# EAGLE design isolated_module_open (EAGLE 6.5.0)
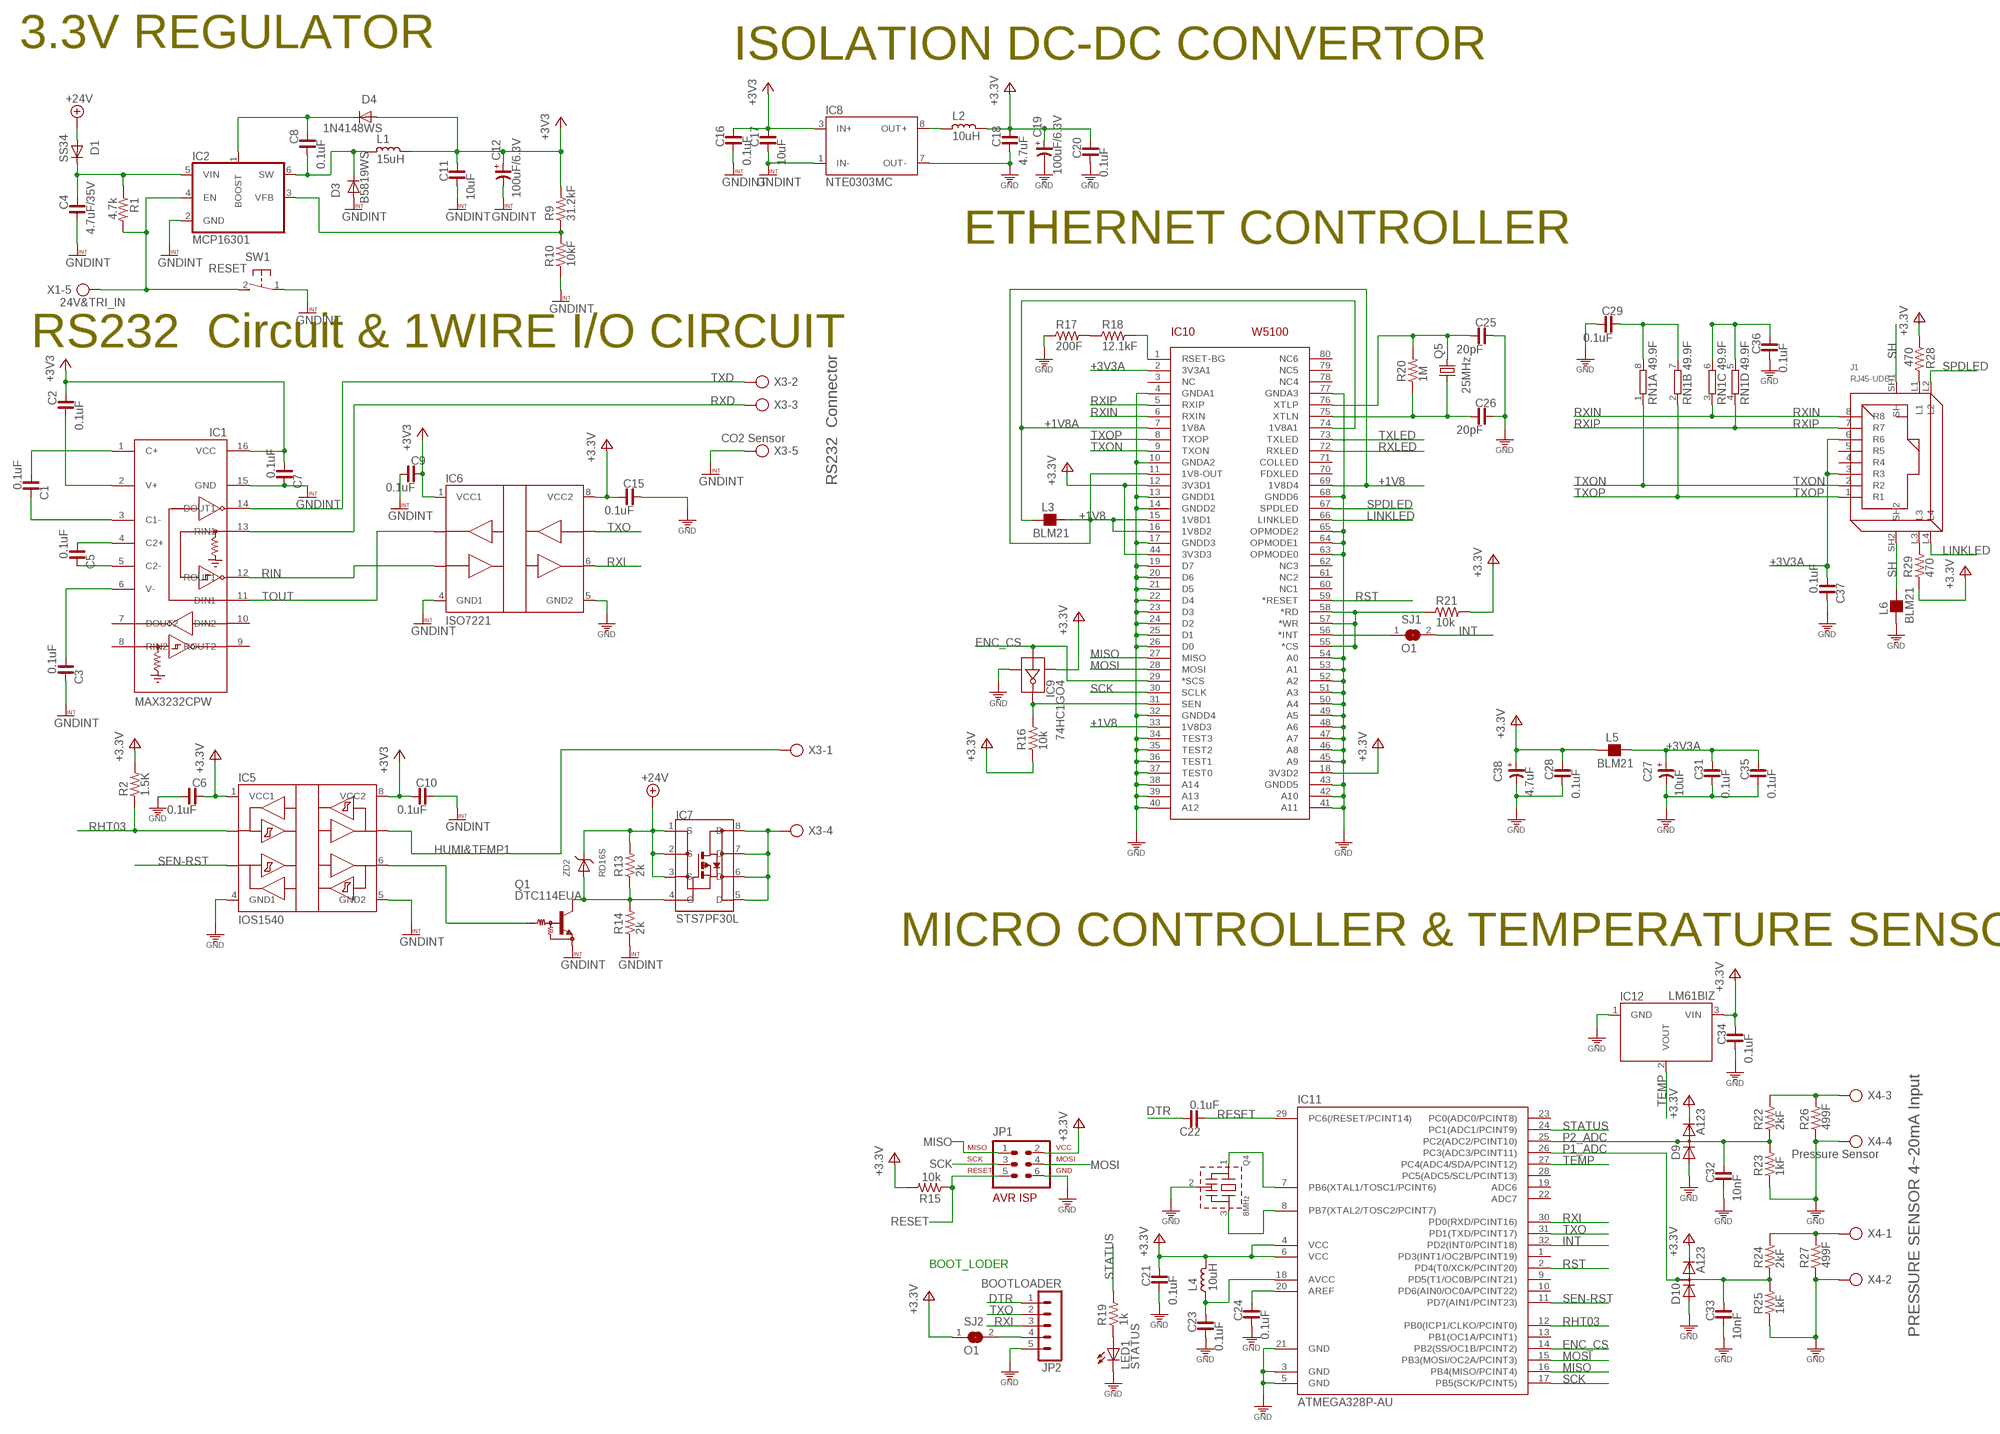
[diagram p0: schematic, sheet 1]

## Parts
C1  0.1uF  C_0603  [C0603]
C2  0.1uF  C_0603  [C0603]
C3  0.1uF  C_0603  [C0603]
C4  4.7uF/35V  C_3225  [C3225]
C5  0.1uF  C_0603  [C0603]
C6  0.1uF  C_0603  [C0603]
C7  0.1uF  C_0603  [C0603]
C8  0.1uF  C_0603  [C0603]
C9  0.1uF  C_0603  [C0603]
C10  0.1uF  C_0603  [C0603]
C11  10uF  C_0805  [C0805]
C12  100uF/6.3V  CP_3528-21  [C3528-21/T]
C15  0.1uF  C_0603  [C0603]
C16  0.1uF  C_0603  [C0603]
C17  10uF  C_0805  [C0805]
C18  4.7uF  C_0805  [C0805]
C19  100uF/6.3V  CP_3528-21  [C3528-21/T]
C20  0.1uF  C_0603  [C0603]
C21  0.1uF  C_0603  [C0603]
C22  0.1uF  C_0603  [C0603]
C23  0.1uF  C_0603  [C0603]
C24  0.1uF  C_0603  [C0603]
C25  20pF  C_0603  [C0603]
C26  20pF  C_0603  [C0603]
C27  10uF  CP_2012  [C2012/T]
C28  0.1uF  C_0603  [C0603]
C29  0.1uF  C_0603  [C0603]
C31  0.1uF  C_0603  [C0603]
C32  10nF  C_0603  [C0603]
C33  10nF  C_0603  [C0603]
C34  0.1uF  C_0603  [C0603]
C35  0.1uF  C_0603  [C0603]
C36  0.1uF  C_0603  [C0603]
C37  0.1uF  C_0603  [C0603]
C38  4.7uF  CP_2012  [C2012/T]
D1  SS34  DIODE-DO214AA  [DO214AA]
D3  B5819WS  B5189WN  [SOD323]
D4  1N4148WS  B5189WN  [SOD323]
D9  A123  DIODE_2CACA-SOT23  [SOT23]
D10  A123  DIODE_2CACA-SOT23  [SOT23]
IC1  MAX3232CPW  MAX3232MAX232CPW  [PW_R-PDSO-G16]
IC2  MCP16301  [SOT23-6L]
IC5  IOS1540  [SO08]
IC6  ISO7221  [SO8]
IC7  STS7PF30L  HEXFET_P  [SO08]
IC8  NTE0303MC  NTE0X0XMC  [NTE0505MC]
IC9  74HC1GO4  74HC1GO4GVSOT753  [SOT753]
IC10  W5100  [SQFP-S-10X10-80]
IC11  ATMEGA328P-AU  ATMEGA48/88/168-AU  [TQFP32-08]
IC12  LM61BIZ  LM61  [TO92-]
J1  RJ45-UDE  [RDA-126B1A1A]
JP1  AVR-ISP-6  [AVR-ISP-6]
JP2  BOOTLOADER  MA05-1IR  [MA05-1-IR]
L1  15uH  L_4545  [L4545]
L2  10uH  L_4545  [L4545]
L3  BLM21  FB_0603  [L0603]
L4  10uH  L_0805  [L0805]
L5  BLM21  FB_0603  [L0603]
L6  BLM21  FB_0603  [L0603]
LED1  STATUS  LEDSMD-1608  [LED-1608]
Q1  DTC114EUA  [SC59-BEC]
Q4  8MHz  X-TAL-SMALLRESONATOR  [CSTLA_X]
Q5  25MHz  CRYSTALSMD5032  [SMD5032]
R1  4.7k  R_0603  [R0603]
R2  1.5K  R_0603  [R0603]
R9  31.2kF  R_0603  [R0603]
R10  10kF  R_0603  [R0603]
R13  2k  R_0603  [R0603]
R14  2k  R_0603  [R0603]
R15  10k  R_0603  [R0603]
R16  10k  R_0603  [R0603]
R17  200F  R_0603  [R0603]
R18  12.1kF  R_0603  [R0603]
R19  1k  R_0603  [R0603]
R20  1M  R_0603  [R0603]
R21  10k  R_0603  [R0603]
R22  2kF  R_0603  [R0603]
R23  1kF  R_0603  [R0603]
R24  2kF  R_0603  [R0603]
R25  1kF  R_0603  [R0603]
R26  499F  R_0805  [R0805]
R27  499F  R_0805  [R0805]
R28  470  R_0603  [R0603]
R29  470  R_0603  [R0603]
RN1  49.9F  4R-N  [ARRAY_R3216]
SJ1  O1  SJ  [SJ]
SJ2  O1  SJ  [SJ]
SW1  RESET  DTSM-3  [DTSM-3]
X1  24V&TRI_IN  AK500/5  [AK500/5]
X3  CO2 Sensor  AK500/5  [AK500/5]
X4  Pressure Sensor  AK500/4  [AK500/4]
ZD2  RD16S  ZENER_DIODERD47S  [DSMM]

## Nets
3V3: C6.1 C15.2 C18.1 C19.+ C20.1 C21.1 C28.1 C34.1 C38.+ D9.2(C) D10.2(C) IC5.1(VCC1) IC6.8(VCC2) IC9.5(VDD) IC10.12(3V3D1) IC10.18(3V3D2) IC10.44(3V3D3) IC11.4(VCC) IC11.6(VCC) IC12.3(VIN) JP1.2 L2.1 L4.1 L5.1 R2.2 R15.2 R16.1 R21.2 R28.1 R29.1 SJ2.1 ; supply symbol labelled +3V3
+1V8: IC10.11(1V8-OUT) IC10.15(1V8D1) IC10.16(1V8D2) IC10.33(1V8D3) IC10.69(1V8D4) L3.2
+1V8A: IC10.7(1V8A) IC10.74(1V8A1) L3.1
+3V3: C2.1 C7.2 C9.1 C10.2 C11.1 C12.+ C16.1 C17.1 D4.A IC1.16(VCC) IC5.8(VCC2) IC6.1(VCC1) IC8.3(IN+) L1.1 R9.2
+3V3A: C27.+ C31.1 C35.1 C37.2 IC10.2(3V3A1) J1.3(R3) J1.6(R6) L5.2
+24V: D1.A IC7.1(S) IC7.2(S) IC7.3(S) R13.2 ZD2.C
DTR: C22.1 JP2.1
ENC_CS: IC9.2(A) IC10.29(*SCS) IC11.14(PB2(SS/OC1B/PCINT2))
GND [GND]: C6.2 C15.1 C18.2 C19.- C20.2 C21.2 C23.2 C24.2 C25.1 C26.1 C27.- C28.2 C29.2 C31.2 C32.2 C33.2 C34.2 C35.2 C36.2 C37.1 C38.- D9.1(A) D10.1(A) IC5.4(GND1) IC6.5(GND2) IC8.7(OUT-) IC9.3(GND) IC10.4(GNDA1) IC10.10(GNDA2) IC10.13(GNDD1) IC10.14(GNDD2) IC10.17(GNDD3) IC10.19(D7) IC10.20(D6) IC10.21(D5) IC10.22(D4) IC10.23(D3) IC10.24(D2) IC10.25(D1) IC10.26(D0) IC10.32(GNDD4) IC10.34(TEST3) IC10.35(TEST2) IC10.36(TEST1) IC10.37(TEST0) IC10.38(A14) IC10.39(A13) IC10.40(A12) IC10.41(A11) IC10.42(A10) IC10.43(GNDD5) IC10.45(A9) IC10.46(A8) IC10.47(A7) IC10.48(A6) IC10.49(A5) IC10.50(A4) IC10.51(A3) IC10.52(A2) IC10.53(A1) IC10.54(A0) IC10.63(OPMODE0) IC10.64(OPMODE1) IC10.65(OPMODE2) IC10.68(GNDD6) IC10.77(GNDA3) IC11.3(GND) IC11.5(GND) IC11.21(GND) IC12.1(GND) JP1.6 JP2.5 L6.1 LED1.C Q4.2(GND) R17.1 R23.1 R25.1 R26.1 R27.1 X4.2 X4.4
GNDINT [GND]: C3.1 C4.2 C7.1 C9.2 C10.1 C11.2 C12.- C16.2 C17.2 D3.A IC1.15(GND) IC2.2(GND) IC5.5(GND2) IC6.4(GND1) IC8.1(IN-) Q1.1(GND) R10.1 R14.1 SW1.1 X3.5
HUMI&TEMP1: IC5.7(SDA2) X3.1
INT: IC11.32(PD2(INT0/PCINT18)) SJ1.2
LINKLED: IC10.66(LINKLED) J1.L4
MISO: IC10.27(MISO) IC11.16(PB4(MISO/PCINT4)) JP1.1
MOSI: IC10.28(MOSI) IC11.15(PB3(MOSI/OC2A/PCINT3)) JP1.4
N$9: C5.1 IC1.5(C2-)
N$11: IC11.7(PB6(XTAL1/TOSC1/PCINT6)) Q4.1(IN)
N$12: IC11.8(PB7(XTAL2/TOSC2/PCINT7)) Q4.3(OUT)
N$13: C5.2 IC1.4(C2+)
N$14: C3.2 IC1.6(V-)
N$15: C2.2 IC1.2(V+)
N$16: C1.2 IC1.1(C+)
N$17: C1.1 IC1.3(C1-)
N$18: R22.2 R26.2 X4.3
N$19: C4.1 D1.C IC2.5(VIN) R1.1
N$20: LED1.A R19.1
N$22: IC10.55(*CS) IC10.57(*WR) IC10.58(*RD) R21.1
N$23: R17.2 R18.1
N$24: J1.L3 R29.2
N$25: J1.L1 R28.2
N$26: C36.1 RN1.5 RN1.6
N$27: IC10.56(*INT) SJ1.1
N$28: C29.1 RN1.7 RN1.8
N$29: IC10.1(RSET-BG) R18.2
N$30: IC8.8(OUT+) L2.2
N$31: C8.2 D3.C IC2.6(SW) L1.2
N$32: IC2.3(VFB) R9.1 R10.2
N$33: C8.1 D4.C IC2.1(BOOST)
N$34: IC2.4(EN) R1.2 SW1.2 X1.5
N$35: R24.2 R27.2 X4.1
N$36: C24.1 IC11.20(AREF)
N$37: C23.1 IC11.18(AVCC) L4.2
N$38: IC7.5(D) IC7.6(D) IC7.7(D) IC7.8(D) X3.4
N$39: IC5.6(SCL2) Q1.2(IN)
N$40: C25.2 IC10.76(XTLP) Q5.3 R20.2
N$41: IC7.4(G) Q1.3(OUT) R13.1 R14.2 ZD2.A
N$42: IC9.4(Y) IC10.31(SEN) R16.2
N$43: JP2.4 SJ2.2
N$49: C26.2 IC10.75(XTLN) Q5.1 R20.1
P1_ADC: C33.1 D10.3(AC) IC11.26(PC3(ADC3/PCINT11)) R24.1 R25.2
P2_ADC: C32.1 D9.3(AC) IC11.25(PC2(ADC2/PCINT10)) R22.1 R23.2
RESET: C22.2 IC11.29(PC6(/RESET/PCINT14)) JP1.5 R15.1
RHT03: IC5.2(SDA1) IC11.12(PB0(ICP1/CLKO/PCINT0)) R2.1
RIN: IC1.12(ROUT1) IC6.3(INB)
RST: IC10.59(*RESET) IC11.2(PD4(T0/XCK/PCINT20))
RXD: IC1.13(RIN1) X3.3
RXI: IC6.6(OUTB) IC11.30(PD0(RXD/PCINT16)) JP2.3
RXIN: IC10.6(RXIN) J1.8(R8) RN1.3
RXIP: IC10.5(RXIP) J1.7(R7) RN1.4
RXLED: IC10.72(RXLED)
SCK: IC10.30(SCLK) IC11.17(PB5(SCK/PCINT5)) JP1.3
SEN-RST: IC5.3(SCL1) IC11.11(PD7(AIN1/PCINT23))
SH: J1.SH1(SH) J1.SH2 L6.2
SPDLED: IC10.67(SPDLED) J1.L2
STATUS: IC11.24(PC1(ADC1/PCINT9)) R19.2
TEMP: IC11.27(PC4(ADC4/SDA/PCINT12)) IC12.2(VOUT)
TOUT: IC1.11(DIN1) IC6.2(OUTA)
TXD: IC1.14(DOUT1) X3.2
TXLED: IC10.73(TXLED)
TXO: IC6.7(INA) IC11.31(PD1(TXD/PCINT17)) JP2.2
TXON: IC10.9(TXON) J1.2(R2) RN1.1
TXOP: IC10.8(TXOP) J1.1(R1) RN1.2
Unconnected: IC1.7(DOUT2) IC1.8(RIN2) IC1.9(ROUT2) IC1.10(DIN2) IC10.3(NC) IC10.60(NC1) IC10.61(NC2) IC10.62(NC3) IC10.70(FDXLED) IC10.71(COLLED) IC10.78(NC4) IC10.79(NC5) IC10.80(NC6) IC11.1(PD3(INT1/OC2B/PCINT19)) IC11.9(PD5(T1/OC0B/PCINT21)) IC11.10(PD6(AIN0/OC0A/PCINT22)) IC11.13(PB1(OC1A/PCINT1)) IC11.19(ADC6) IC11.22(ADC7) IC11.23(PC0(ADC0/PCINT8)) IC11.28(PC5(ADC5/SCL/PCINT13)) J1.4(R4) J1.5(R5) X1.1 X1.2 X1.3 X1.4

## Notes on the sheet
- 3.3V REGULATOR | ISOLATION DC-DC CONVERTOR
- ETHERNET CONTROLLER
- RS232  Circuit & 1WIRE I/O CIRCUIT
- RS232  Connector
- MICRO CONTROLLER & TEMPERATURE SENSOR
- BOOT_LODER
- PRESSURE SENSOR 4~20mA Input

## Library data of the parts
C1-C11 C15-C18 C20-C26 C28 C29 C31-C37 = cona_lib:C_: NON-POLARIZED CAP
C12 C19 C27 C38 = rc-master-smd:CP_: POLARIZED CAP
D1 = cona_lib:DIODE-: DIODE
D3 D4 = cona_lib:B5189W
D9 D10 = diode:DIODE_2CACA-: 2 Diodes - Cathode-Anode|Cathode-Anode
IC1 = cona_lib:MAX3232: TI
IC2 = cona_lib:MCP16301
IC5 = cona_lib:IOS1540: Low-Power Bidirectional I 2C Isolators Supports up to 1 MHz Operation 3-V to 5.5-V Supply Range
IC6 = cona_lib:ISO7221
IC7 = cona_lib:HEXFET_P
IC8 = cona_lib:NTE0X0XMC
IC9 = cona_lib:74HC1GO4GV
IC10 = SmartPrj:W5100
IC11 = cona_lib:ATMEGA48/88/168
IC12 = cona_lib:LM61
J1 = cona_lib:RJ45-UDE
JP1 = cona_lib:AVR-ISP-6: AVR ISP-6 Serial Programming Header
JP2 = cona_lib:MA05-1
L1 L2 L4 = cona_lib:L_: INDUCTOR
L3 L5 L6 = rc-master-smd:FB_: FERRITE BEAD
LED1 = cona_lib:LED: LED OSRAM: - CHIPLED LG R971, LG N971, LY N971, LG Q971, LY Q971, LO R971, LY R971 LH N974, LH R974 LS Q976, LO Q976, LY Q976 LO Q996 - Hyper CHIPLED LW Q18S LB Q993, LB Q99A, LB R99A - SideLED LS A670, LO A670, LY A670, LG A670, LP A670 LB A673, LV A673, LT A673, LW A673 LH A674 LY A675 LS A676, LA A676, LO A676, LY A676, LW A676 LS A679, LY A679, LG A679 - Hyper Micro SIDELED® LS Y876, LA Y876, LO Y876, LY Y876 LT Y87S - SmartLED LW L88C, LW L88S LB L89C, LB L89S, LG L890 LS L89K, LO L89K, LY L89K LS L896, LA L896, LO L896, LY L896 - TOPLED LS T670, LO T670, LY T670, LG T670, LP T670 LSG T670, LSP T670, LSY T670, LOP T670, LYG T670 LG T671, LOG T671, LSG T671 LB T673, LV T673, LT T673, LW T673 LH T674 LS T676, LA T676, LO T676, LY T676, LB T676, LH T676, LSB T676, LW T676 LB T67C, LV T67C, LT T67C, LS T67K, LO T67K, LY T67K, LW E67C LS E67B, LA E67B, LO E67B, LY E67B, LB E67C, LV E67C, LT E67C LW T67C LS T679, LY T679, LG T679 LS T770, LO T770, LY T770, LG T770, LP T770 LB T773, LV T773, LT T773, LW T773 LH T774 LS E675, LA E675, LY E675, LS T675 LS T776, LA T776, LO T776, LY T776, LB T776 LHGB T686 LT T68C, LB T68C - Hyper Mini TOPLED® LB M676 - Mini TOPLED Santana® LG M470 LS M47K, LO M47K, LY M47K Source: http://www.osram.convergy.de LUXEON: - LUMILED® LXK2-PW12-R00, LXK2-PW12-S00, LXK2-PW14-U00, LXK2-PW14-V00 LXK2-PM12-R00, LXK2-PM12-S00, LXK2-PM14-U00 LXK2-PE12-Q00, LXK2-PE12-R00, LXK2-PE12-S00, LXK2-PE14-T00, LXK2-PE14-U00 LXK2-PB12-K00, LXK2-PB12-L00, LXK2-PB12-M00, LXK2-PB14-N00, LXK2-PB14-P00, LXK2-PB14-Q00 LXK2-PR12-L00, LXK2-PR12-M00, LXK2-PR14-Q00, LXK2-PR14-R00 LXK2-PD12-Q00, LXK2-PD12-R00, LXK2-PD12-S00 LXK2-PH12-R00, LXK2-PH12-S00 LXK2-PL12-P00, LXK2-PL12-Q00, LXK2-PL12-R00 Source: www.luxeon.com KINGBRIGHT: KA-3528ASYC Source: www.kingbright.com
Q1 = cona_lib:DTC114EUA: NPN Bias Resistor Transistor
Q4 = cona_lib:X-TAL-SMALL: Ceramic Resonators MuRata CSTCE08MOOG52A
Q5 = cona_lib:CRYSTAL: CRYSTAL
R1 R2 R9 R10 R13-R29 = cona_lib:R_: RESISTOR
RN1 = cona_lib:4R-N: Array Chip Resistor Source: RS Component / Phycomp
SJ1 SJ2 = cona_lib:SJ: SMD solder JUMPER
SW1 = switch-tact:DTSM-3
X1 X3 = con-ptr500:AK500/5: CONNECTOR; OC_FARNELL: unknown; OC_NEWARK: unknown
X4 = con-ptr500:AK500/4: CONNECTOR; OC_FARNELL: unknown; OC_NEWARK: unknown
ZD2 = GRU-EURO6:ZENER_DIODE

## Net classes
0 default: clearance 0.152 mm
1 +5V: width 0.2 mm, clearance 0.152 mm
2 GND: width 0.2 mm, drill 0.2 mm, clearance 0.152 mm

## Board
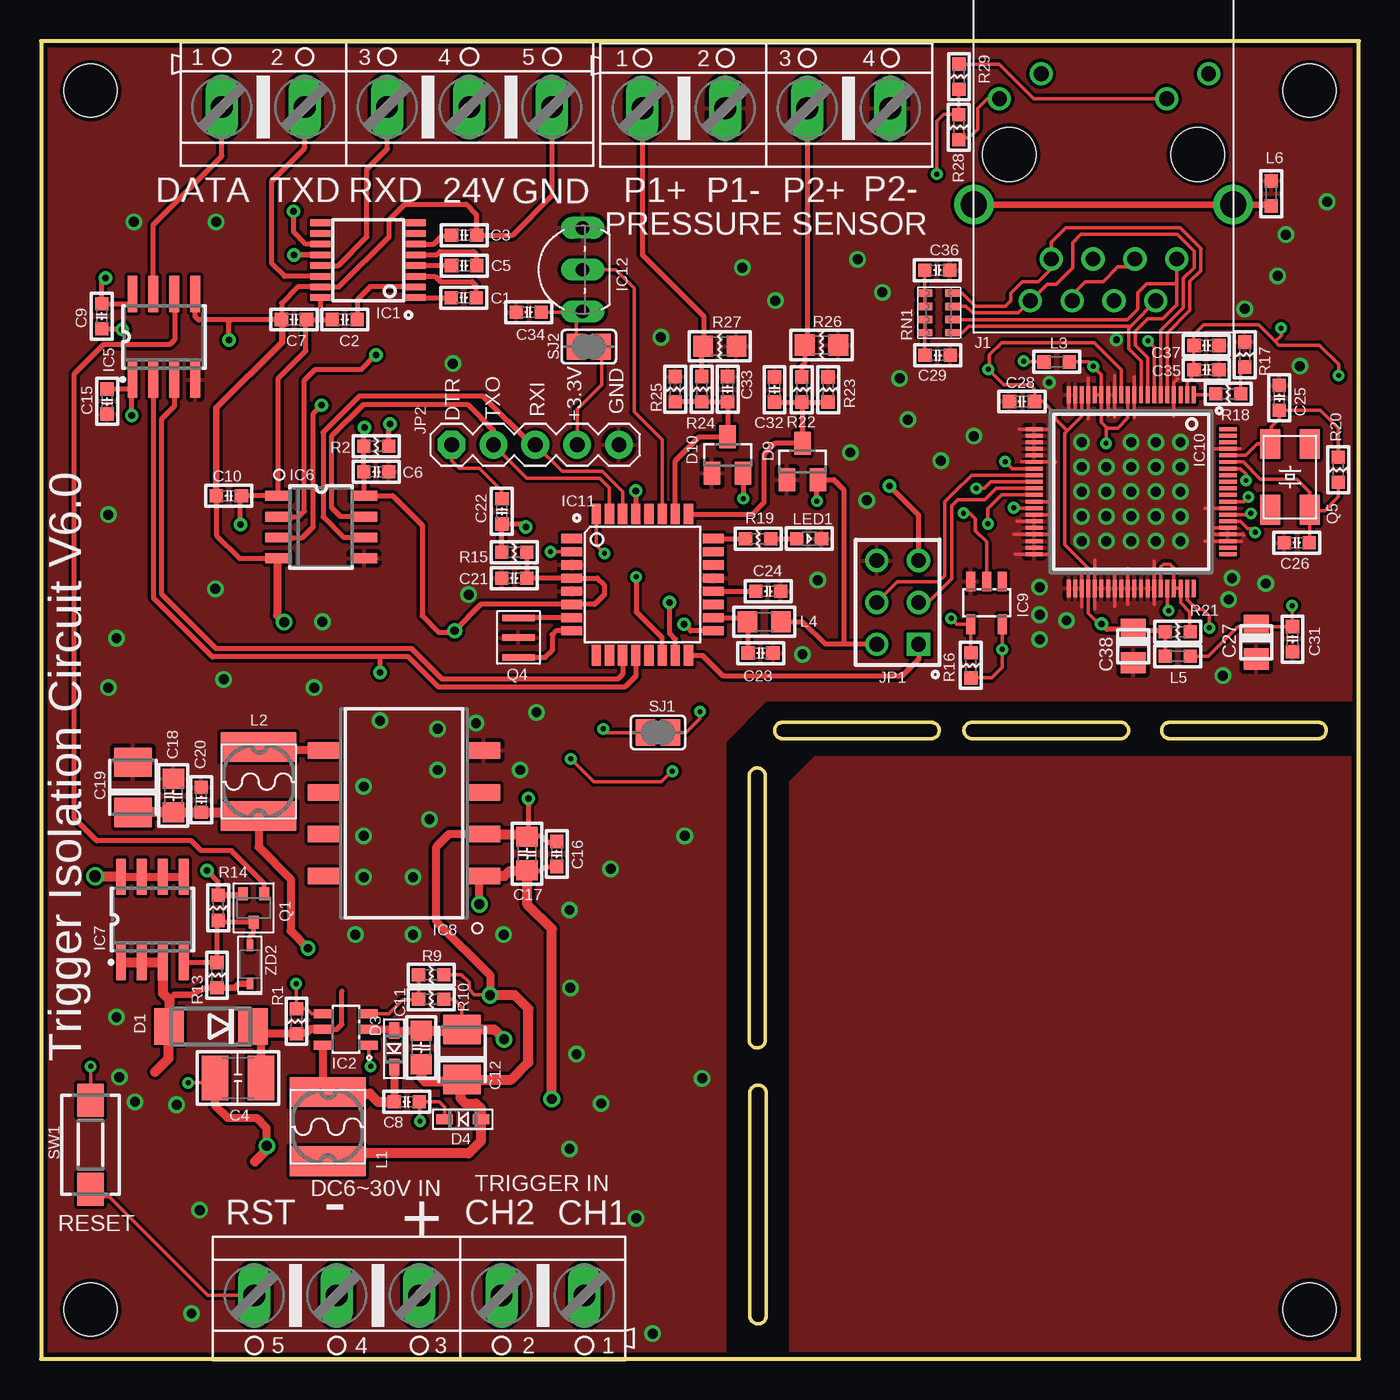
[diagram p1: board, top side]
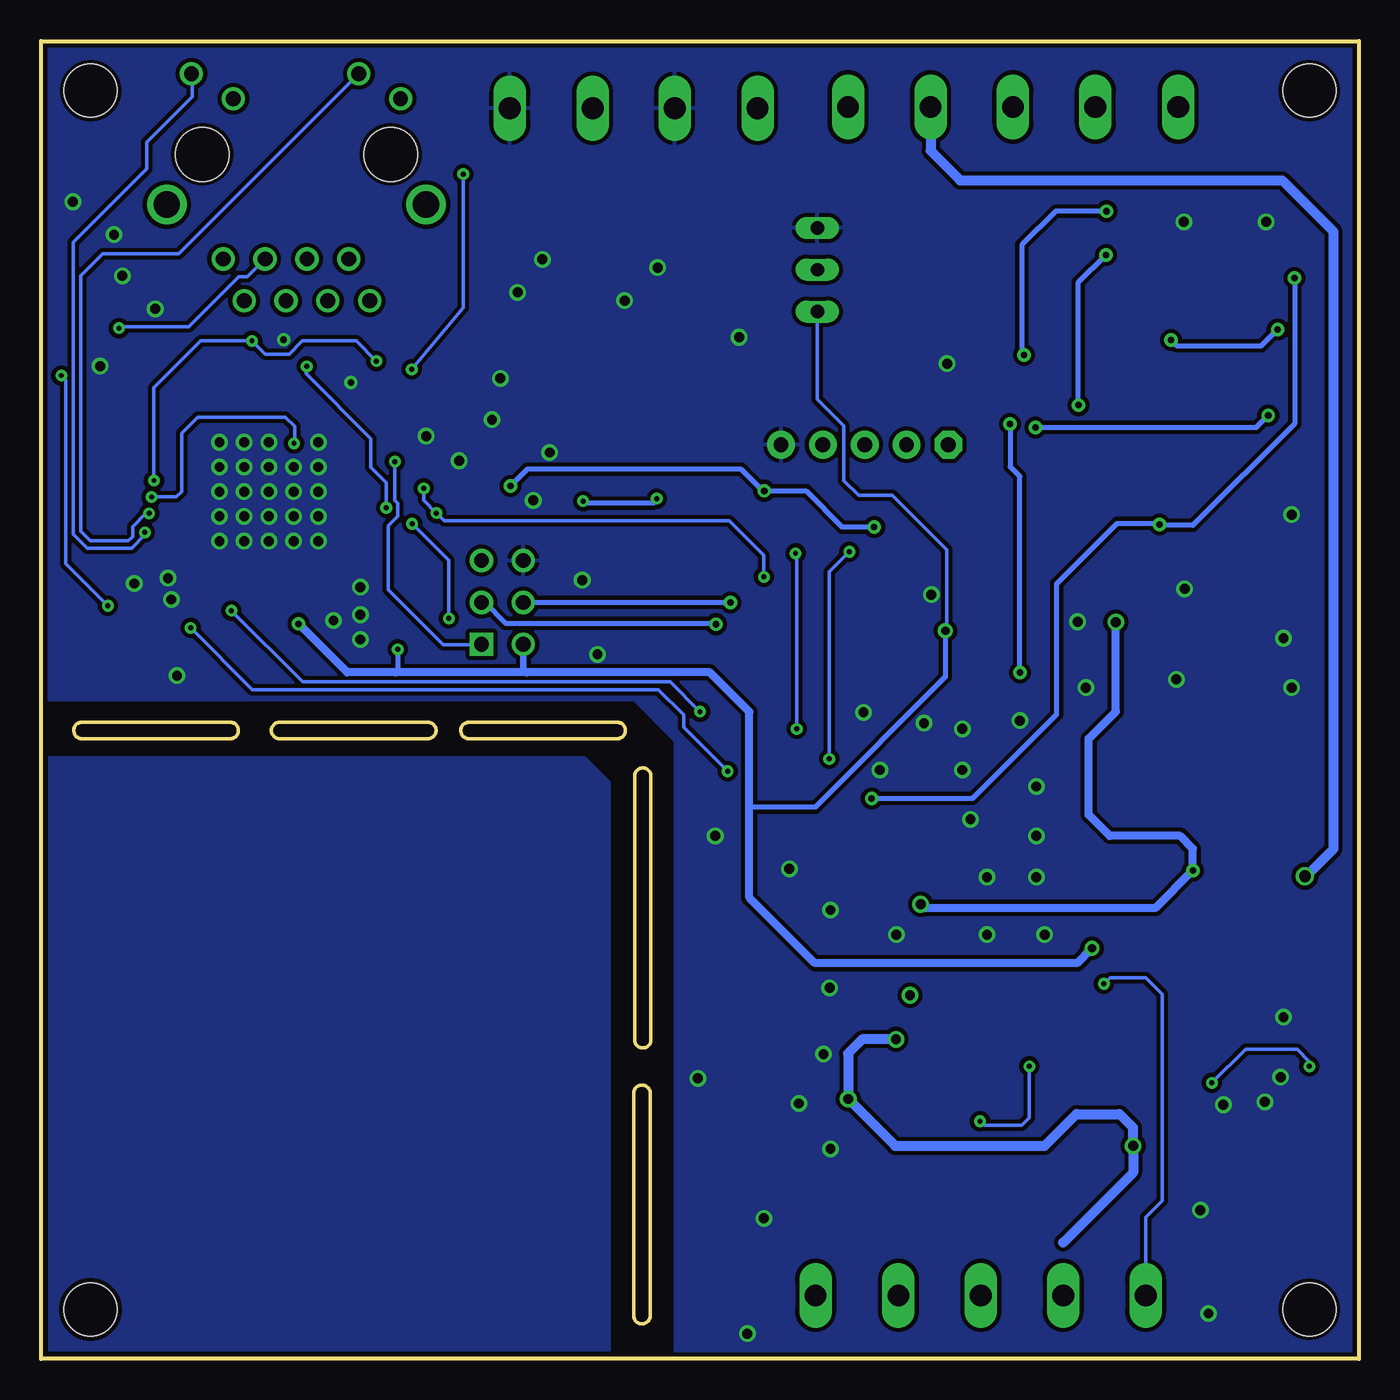
[diagram p2: board, bottom side, seen from below]

Size 80 x 80 mm. Coordinates in mm from the lower left corner, seen from the top.
Outline: 0,0 80,0 80,80 0,80 0,0
Outline: 45.02,38.65 54.02,38.65 arc-90 54.52,38.15 arc-90 54.02,37.65 45.02,37.65 arc-90 44.52,38.15 arc-90 45.02,38.65
Outline: 56.52,38.65 65.53,38.65 arc-90 66.03,38.15 arc-90 65.53,37.65 56.52,37.65 arc-90 56.02,38.15 arc-90 56.52,38.65
Outline: 68.53,38.65 77.53,38.65 arc-90 78.03,38.15 arc-90 77.53,37.65 68.53,37.65 arc-90 68.03,38.15 arc-90 68.53,38.65
Outline: 42.98,19.38 42.98,35.38 arc-90 43.48,35.88 arc-90 43.98,35.38 43.98,19.38 arc-90 43.48,18.88 arc-90 42.98,19.38
Outline: 43.02,2.62 43.02,16.12 arc-90 43.52,16.62 arc-90 44.02,16.12 44.02,2.62 arc-90 43.52,2.12 arc-90 43.02,2.62
Copper layers (1*16): Top 0.035mm / dielectric 1.5mm / Bottom 0.035mm
Design rules "default": minimum track width 0.2mm, minimum drill 0.3mm, track to track 0.2mm, track to pad 0.2mm, pad to pad 0.2mm, via to via 0.2mm, smd to smd 0.2mm, copper to edge 10mil, drill to drill 0.2mm, minimum pad ring 10mil, minimum via ring 8mil, stop-mask expansion 4mil, vias tented up to drill 0mil, thermal gap 10mil
Holes 3.2 mm at 3,77 77,77 77,3 3,3

### Footprints (pad centres in the part's own frame; a part is rotated, then mirrored left to right if it is on the bottom)
C0603 = smd 0.8 x 0.8: 1 -0.762,0; 2 0.762,0
C3225 = smd 1.6 x 2.7: 1 -1.397,0; 2 1.397,0
C0805 = smd 1.2 x 1.3: 1 -1.016,0; 2 1.016,0
C3528-21/T = smd 1.778 x 2.286: + 1.524,0; - -1.524,0
C2012/T = smd 1.3 x 1.5: + 1.016,0; - -1.016,0
DO214AA = smd 1.8 x 2.2: A 2.55,0; C -2.55,0
SOD323 = smd 1 x 0.6: A 1.1,0; C -1.1,0
SOT23 = smd 1 x 1.4: 1 -0.95,-1.1; 2 0.95,-1.1; 3 0,1.1
PW_R-PDSO-G16 = smd 0.4 x 1.2: 1 -2.275,-2.9; 2 -1.625,-2.9; 3 -0.975,-2.9; 4 -0.325,-2.9; 5 0.325,-2.9; 6 0.975,-2.9; 7 1.625,-2.9; 8 2.275,-2.9; 9 2.275,2.9; 10 1.625,2.9; 11 0.975,2.9; 12 0.325,2.9; 13 -0.325,2.9; 14 -0.975,2.9; 15 -1.625,2.9; 16 -2.275,2.9
SOT23-6L = smd 0.55 x 1.1: 1 -0.95,-1.4; 2 0,-1.4; 3 0.95,-1.4; 4 0.95,1.4; 5 0,1.4; 6 -0.95,1.4
SO08 = smd 0.6 x 2.2: 1 -1.905,-2.6; 2 -0.635,-2.6; 3 0.635,-2.6; 4 1.905,-2.6; 5 1.905,2.6; 6 0.635,2.6; 7 -0.635,2.6; 8 -1.905,2.6
SO8 = smd 0.6 x 1.6: 1 -1.905,-2.6; 2 -0.635,-2.6; 3 0.635,-2.6; 4 1.905,-2.6; 5 1.905,2.6; 6 0.635,2.6; 7 -0.635,2.6; 8 -1.905,2.6
NTE0505MC = smd 1 x 2: 1 -3.81,-4.85; 3 -1.27,-4.85; 5 1.27,-4.85; 7 3.81,-4.85; 8 3.81,4.85; 10 1.27,4.85; 12 -1.27,4.85; 14 -3.81,4.85
SOT753 = smd 0.55 x 1.2: 1 -0.95,-1.3; 2 0,-1.3; 3 0.95,-1.3; 4 0.95,1.3; 5 -0.95,1.3
SQFP-S-10X10-80 = smd 0.241 x 1.041: 1 -3.8,-5.879; 2 -3.4,-5.879; 3 -3,-5.879; 4 -2.6,-5.879; 5 -2.2,-5.879; 6 -1.8,-5.879; 7 -1.4,-5.879; 8 -1,-5.879; 9 -0.6,-5.879; 10 -0.2,-5.879; 11 0.2,-5.879; 12 0.6,-5.879; 13 1,-5.879; 14 1.4,-5.879; 15 1.8,-5.879; 16 2.2,-5.879; 17 2.6,-5.879; 18 3,-5.879; 19 3.4,-5.879; 20 3.8,-5.879; 41 3.8,5.879; 42 3.4,5.879; 43 3,5.879; 44 2.6,5.879; 45 2.2,5.879; 46 1.8,5.879; 47 1.4,5.879; 48 1,5.879; 49 0.6,5.879; 50 0.2,5.879; 51 -0.2,5.879; 52 -0.6,5.879; 53 -1,5.879; 54 -1.4,5.879; 55 -1.8,5.879; 56 -2.2,5.879; 57 -2.6,5.879; 58 -3,5.879; 59 -3.4,5.879; 60 -3.8,5.879 | smd 1.041 x 0.241: 21 5.879,-3.8; 22 5.879,-3.4; 23 5.879,-3; 24 5.879,-2.6; 25 5.879,-2.2; 26 5.879,-1.8; 27 5.879,-1.4; 28 5.879,-1; 29 5.879,-0.6; 30 5.879,-0.2; 31 5.879,0.2; 32 5.879,0.6; 33 5.879,1; 34 5.879,1.4; 35 5.879,1.8; 36 5.879,2.2; 37 5.879,2.6; 38 5.879,3; 39 5.879,3.4; 40 5.879,3.8; 61 -5.879,3.8; 62 -5.879,3.4; 63 -5.879,3; 64 -5.879,2.6; 65 -5.879,2.2; 66 -5.879,1.8; 67 -5.879,1.4; 68 -5.879,1; 69 -5.879,0.6; 70 -5.879,0.2; 71 -5.879,-0.2; 72 -5.879,-0.6; 73 -5.879,-1; 74 -5.879,-1.4; 75 -5.879,-1.8; 76 -5.879,-2.2; 77 -5.879,-2.6; 78 -5.879,-3; 79 -5.879,-3.4; 80 -5.879,-3.8
TQFP32-08 = smd 1.27 x 0.559: 1 -4.293,2.8; 2 -4.293,2; 3 -4.293,1.2; 4 -4.293,0.4; 5 -4.293,-0.4; 6 -4.293,-1.2; 7 -4.293,-2; 8 -4.293,-2.8; 17 4.293,-2.8; 18 4.293,-2; 19 4.293,-1.2; 20 4.293,-0.4; 21 4.293,0.4; 22 4.293,1.2; 23 4.293,2; 24 4.293,2.8 | smd 0.559 x 1.27: 9 -2.8,-4.293; 10 -2,-4.293; 11 -1.2,-4.293; 12 -0.4,-4.293; 13 0.4,-4.293; 14 1.2,-4.293; 15 2,-4.293; 16 2.8,-4.293; 25 2.8,4.293; 26 2,4.293; 27 1.2,4.293; 28 0.4,4.293; 29 -0.4,4.293; 30 -1.2,4.293; 31 -2,4.293; 32 -2.8,4.293
TO92- = drill 0.813 long: 1 2.54,0; 2 0,0; 3 -2.54,0
RDA-126B1A1A = drill 0.9: 1 -6.35,-4.445; 2 -8.89,-3.175; 3 -6.35,-1.905; 4 -8.89,-0.635; 5 -6.35,0.635; 6 -8.89,1.905; 7 -6.35,3.175; 8 -8.89,4.445 | drill 0.89: L1 3.38,6.325; L2 4.9,3.785; L3 3.38,-3.835; L4 4.9,-6.375 | drill 1.6: SH1 -3.05,7.875; SH2 -3.05,-7.875 | hole 3.25: 0,-5.715; 0,5.715
AVR-ISP-6 = drill 0.9 square: 1 -2.54,-1.27 | drill 0.9: 2 -2.54,1.27; 3 0,-1.27; 4 0,1.27; 5 2.54,-1.27; 6 2.54,1.27
MA05-1-IR = drill 0.9 pad 1.676 octagon: 1 -5.08,0 | drill 0.9 pad 1.676: 2 -2.54,0; 3 0,0; 4 2.54,0; 5 5.08,0
L4545 = smd 1.8 x 4.6: 1 -2.1,0; 2 2.1,0
L0603 = smd 0.8 x 0.8: 1 -0.762,0; 2 0.762,0
L0805 = smd 1.2 x 1.3: 1 -1.016,0; 2 1.016,0
LED-1608 = smd 0.8 x 0.8: A -0.75,0; C 0.75,0
SC59-BEC = smd 0.6 x 0.8: 1 0.65,-0.863; 2 -0.65,-0.863; 3 0,0.863
CSTLA_X = smd 0.4 x 2: 1 -1.19,-0.02; 2 0.01,-0.02; 3 1.21,-0.02
SMD5032 = smd 1.8 x 1.2: 1 -2,-1.2; 2 2,-1.2; 3 2,1.2; 4 -2,1.2
R0603 = smd 0.8 x 0.8: 1 -0.762,0; 2 0.762,0
R0805 = smd 1.2 x 1.3: 1 -1.016,0; 2 1.016,0
ARRAY_R3216 = smd 0.45 x 0.9: 1 -1.2,-0.85; 2 -0.4,-0.85; 3 0.4,-0.85; 4 1.2,-0.85; 5 1.2,0.85; 6 0.4,0.85; 7 -0.4,0.85; 8 -1.2,0.85
SJ = smd 1.168 x 1.6: 1 -0.762,0; 2 0.762,0
DTSM-3 = smd 2 x 1.6: 1 -2.7,0; 2 2.7,0
AK500/5 = drill 1.321 long: 1 -10.033,0; 2 -5.004,0; 3 0,0; 4 5.004,0; 5 10.008,0
AK500/4 = drill 1.321 long: 1 -7.518,0; 2 -2.489,0; 3 2.489,0; 4 7.518,0
DSMM = smd 0.7 x 0.4: A 1.15,0; C -1.15,0

### Placement (x,y rotation side)
C1  25.65,64.42 180 top
C2  18.43,63.1 0 top
C3  25.68,68.22 180 top
C4  11.95,17.05 180 top
C5  25.68,66.38 180 top
C6  20.35,53.85 0 top
C7  15.35,63.1 0 top
C8  22.2,15.6 180 top
C9  3.67,63.3 270 top
C10  11.4,52.4 0 top
C11  23.07,18.9 90 top
C12  25.55,18.48 270 top
C15  4,58.12 90 top
C16  31.3,30.65 270 top
C17  29.5,30.68 270 top
C18  8.03,34.2 90 top
C19  5.58,34.7 270 top
C20  9.72,33.95 90 top
C21  28.73,47.4 180 top
C22  27.98,51.45 270 top
C23  43.67,42.85 0 top
C24  44.15,46.6 0 top
C25  75.17,58.35 270 top
C26  76.22,49.55 0 top
C27  73.78,43.5 90 top
C28  59.55,58.12 180 top
C29  54.42,60.92 0 top
C31  75.97,43.7 270 top
C32  44.52,58.85 90 top
C33  41.67,58.88 90 top
C34  29.6,63.55 180 top
C35  70.75,60.05 0 top
C36  54.4,66.1 0 top
C37  70.75,61.52 180 top
C38  66.3,43.27 90 top
D1  10.3,20.18 180 top
D3  21.43,18.82 90 top
D4  25.6,14.55 0 top
D9  46.23,54.48 0 top
D10  41.67,54.88 0 top
IC1  19.85,66.7 90 top
IC2  18.5,20 90 top
IC5  7.45,62.05 0 top
IC6  17,50.5 270 top
IC7  6.75,26.68 0 top
IC8  22.02,33.12 90 top
IC9  57.4,45.9 180 top
IC10  66.17,52.65 180 top
IC11  36.5,47 0 top
IC12  32.88,66.12 90 top
J1  64.5,73.12 90 top
JP1  52,45.92 90 top
JP2  30,55.5 0 top
L1  17.4,14.1 90 top
L2  13.2,35.05 90 top
L3  61.65,60.52 0 top
L4  43.9,44.75 180 top
L5  69,42.65 0 top
L6  74.67,70.75 270 top
LED1  46.62,49.8 0 top
Q1  12.9,27.38 180 top
Q4  29,43.8 270 top
Q5  75.83,53.55 90 top
R1  15.5,20.5 90 top
R2  20.35,55.4 180 top
R9  23.68,23.32 0 top
R10  23.68,21.82 180 top
R13  10.68,23.3 270 top
R14  10.75,27.38 270 top
R15  28.73,48.98 0 top
R16  56.45,42.1 90 top
R17  73.08,60.98 270 top
R18  72.08,58.6 180 top
R19  43.52,49.8 180 top
R20  78.75,53.98 90 top
R21  69,44.15 180 top
R22  46.17,58.85 90 top
R23  47.77,58.85 270 top
R24  40.1,58.88 90 top
R25  38.5,58.88 270 top
R26  47.38,61.55 180 top
R27  41.2,61.48 180 top
R28  55.7,74.78 270 top
R29  55.73,77.85 90 top
RN1  54.5,63.5 90 top
SJ1  37.45,38.02 180 top
SJ2  33.25,61.45 0 top
SW1  3,13 270 top
X1  22.95,3.85 180 top
X3  21,76 0 top
X4  44.02,75.92 0 top
ZD2  12.68,23.95 90 top

### Tracks (layer width: path | path; a pad name or v marks a point on that pad's centre or on a via)
3V3  (via drill 0.3, 0.4, 0.5)
  Top 0.2: IC9.5 v58.35,43.08 58.35,41.98 57.71,41.34 R16.1 | v64.38,44.62 64.36,44.64 64.22,44.64 63.58,45.28 IC10.44 63.58,48 62.15,49.42 62.15,56.2 62.3,56.35 | 68.19,44.44 68.19,44.2 68.19,44.15 R21.2 L5.1 | IC10.18 63.17,57.23 62.3,56.35 | v54.38,71.92 54.38,75.12 54.8,75.55 55.69,75.55 R28.1 55.7,77.06 R29.1 | 57.52,60.1 v57.5,60.08 | 62.3,56.35 61.6,57.05 61.6,57.33 60.8,58.12 C28.1 60.33,58.64 60.33,58.85 60.05,59.12 58.45,59.12 v57.5,60.08 | 57.55,60.12 v57.5,60.08 | v57.5,60.08 57.58,60.15 57.58,60.95 58.33,61.7 63.92,61.7 65.58,60.05 IC10.12 | SJ2.1 32.49,63.2 IC12.3 32.84,63.55 C34.1
  Top 0.3: JP1.2 48.8,43.38 | 48.8,43.38 47.59,43.38 46.25,44.73 44.94,44.73 L4.1 | 64.39,44.64 v64.38,44.62 | 68.19,44.2 66.21,44.2 | 64.63,44.37 v64.38,44.62 | 48.8,43.38 48.73,43.46 48.73,52.77 48.12,53.38 D9.2 47.1,53.3 v47.1,52.08 | D10.2 v42.62,52.23 | R15.2 C21.1 IC11.4 33.77,47.4 34.17,47 34.17,46.38 33.6,45.8 IC11.6 26.7,45.8 v25.1,44.2 25.02,44.12 24.1,44.12 23.12,45.1 23.12,50.62 21.34,52.41 IC6.8 19.6,53.84 C6.1 R2.2 19.59,56.51 v19.62,56.55 | C15.2 5.44,58.89 5.5,58.83 | 5.5,58.83 5.5,59.41 IC5.1 | v5.5,57.27 5.5,58.83 | v64.38,44.62 64.71,44.29 C38.+ 66.21,44.2 | 66.2,44.2 66.21,44.2
  Top 0.5: v16.2,24.93 15.15,25.98 15.15,29.12 13.2,31.07 L2.1
  Top 0.6: L2.1 13.16,33.19 C20.1 C18.1 C19.+
  Bottom 0.2: v57.5,60.08 54.38,63.83 v54.38,71.92 | v25.1,44.2 25.02,44.27 25.02,49.12 28.32,52.42 30.38,52.42 31.27,53.33 31.27,56.65 32.88,58.25 IC12.3
  Bottom 0.3: v64.38,44.62 64.15,44.62 | v42.62,52.23 42.62,52.15 42.83,51.95 46.98,51.95 v47.1,52.08 | 37,33.5 33,33.5 25.1,41.4 v25.1,44.2 | v58.35,43.08 58.35,41.83 58.5,41.67 | v19.62,56.55 6.22,56.55 v5.5,57.27
  Bottom 0.4: JP1.2 50.73,41.91 50.5,41.67
  Bottom 0.5: v64.38,44.62 61.42,41.67 58.5,41.67 50.5,41.67 39.4,41.67 37,39.27 37,33.5 37,28 33.02,24.02 17.1,24.02 v16.2,24.93
+1V8  (via drill 0.3)
  Top 0.2: IC10.15 IC10.16 | IC10.11 65.97,57.12 65.35,56.5 64.72,56.5 | 64.72,56.5 64.38,56.85 IC10.15 | IC10.69 73.03,52.05 v73.3,52.33 | IC10.33 59.15,51.65 v59.05,51.67 | v64.65,55.58 64.65,56.42 64.72,56.5 | IC10.15 64.38,59.75 v63.88,60.25 63.6,60.52 L3.2
  Bottom 0.2: v59.05,51.67 59.05,53.2 59.98,54.12 59.98,55.88 63.9,59.8 v63.88,60.25 | v73.3,52.33 71.8,52.33 71.47,52.65 71.47,56.2 70.5,57.17 65.17,57.17 64.61,56.61 64.61,55.61 v64.65,55.58
+1V8A  (via drill 0.3)
  Top 0.2: IC10.74 72.8,54.05 73.15,53.7 v73.15,53.33 | IC10.7 67.58,61.42 v67.2,61.8 | L3.1 59.7,60.52 v59.65,60.58
  Bottom 0.2: v73.15,53.33 73.17,53.35 73.17,58.95 70.33,61.8 v67.2,61.8 66.4,61 64.95,61 64.15,61.8 60.88,61.8 v59.65,60.58
+3V3  (via drill 0.4, 0.6)
  Top 0.2: R9.2 25.5,23.32 25.98,22.85 25.98,22.43 26.3,22.1 27.23,22.1 v27.25,22.07
  Top 0.3: 17.55,63.21 C2.1 17.02,63.1 | v29.57,34.02 29.57,31.77 | 29.57,31.77 C17.1 | 17.02,63.1 C7.2 16.07,63.06 16.07,61.2 14.4,59.52 IC6.1 C10.2 12.1,52.34 v12.1,50.65 | IC1.16 16.95,63.17 17.02,63.1 | IC5.8 5.5,64.61 5.5,64 5.44,64.06 C9.1 3.67,65.4 v3.9,65.62 | 29.57,31.77 30.36,31.77 30.75,31.38 31.26,31.38 C16.1 | 25.45,16.85 C12.+
  Top 0.5: IC8.3 24.75,31.86 24,31.1 24,26.55 27.27,23.27 27.27,22.1 v27.25,22.07
  Top 0.6: IC8.3 29.34,31.86 C17.1 | C11.1 23.07,17.07 23.3,16.85 25.45,16.85 25.45,15.83 25.77,15.5 26.4,15.5 26.7,15.2 D4.A 26.7,13.22 25.95,12.47 17.77,12.47 L1.1 | C12.+ 28.53,16.95 29.57,18 29.57,21.25 28.75,22.07 v27.25,22.07
  Bottom 0.3: v3.9,65.62 3.9,56.77 10.07,50.6 12.05,50.6 v12.1,50.65 12.18,50.73 14.68,50.73 18.35,47.05 18.35,39.12 23.45,34.02 v29.57,34.02
+3V3A  (via drill 0.3)
  Top 0.2: 74.05,44.46 C31.1 75.95,44.49 v75.95,45.73 | 69.8,60.33 C35.1 | L5.2 70.85,42.65 72.65,44.45 74.02,44.45 | v78.78,59.7 78.78,60.38 77.6,61.55 75.15,61.55 74.92,61.77 | 74.92,61.77 73.92,62.77 70.6,62.77 69.99,62.16 C37.2 C35.1 | IC10.2 69.58,59.27 69.83,59.52 69.83,59.89 C35.1 | v75.28,62.58 75.28,62.12 74.92,61.77 | J1.6 62.59,64.59 63.4,65.4 64.47,65.4 65.38,66.3 65.93,66.3 J1.3
  Top 0.3: 74.02,44.45 73.84,44.45 C27.+ 73.83,44.46 74.05,44.46
  Bottom 0.2: v75.95,45.73 78.5,48.27 78.5,59.42 v78.78,59.7 | v75.28,62.58 75.2,62.65 71.05,62.65 68,65.7 67.48,65.7 J1.3
+24V
  Top 0.4: ZD2.C 12.65,22.77 12,22.77 11.76,22.54 R13.2 10.01,22.54 9.07,22.1 8.07,22.1 7.78,21.8
  Top 0.5: 7.72,20.15 D1.A
  Top 0.6: 7.72,20.15 7.72,18.23 6.92,17.41 | IC7.1 IC7.2 IC7.3 7.38,22.19 7.78,21.8 7.78,20.2 D1.A 7.7,20.23
DTR
  Top 0.2: C22.1 27.98,52.7 26.6,54.08 25.38,54.08 24.92,54.53 JP2.1
ENC_CS  (via drill 0.3)
  Top 0.2: IC10.29 57.65,53.25 57.25,52.85 v56.77,52.85 | IC9.2 57.4,49.6 56.73,50.27 56.73,51 56.38,51.35 v56,51.35
  Top 0.3: IC11.14 37.7,43.77 36.12,45.35 v36.12,47.48
  Bottom 0.2: v56.77,52.85 56.77,52.12 v56,51.35 55.52,50.88 38.23,50.88 36.12,48.77 v36.12,47.48
GND  (via drill 0.4, 0.6)
  Top 0.2: 62.77,57.73 IC10.19 62.77,57.42 | IC10.32 61.45,52.05 | IC10.34 61.25,51.25 | 70.65,49.65 IC10.63 72.85,49.65 | IC10.68 70.65,51.65 | 73,50 72.95,50.05 IC10.64 71.05,50.05 71,50 | IC10.65 71.05,50.45 71,50.5 | 71.25,55.25 IC10.77 72.8,55.25 | 68.78,57.23 IC10.4 68.78,59.27 69,59.5 | 66.38,57.12 IC10.10 66.38,59.62 | 65.17,57.17 IC10.13 65.17,59.67 | IC10.14 64.78,57.27 | 63.58,57.08 IC10.17 63.58,59.55 | IC10.20 62.38,57.62 | 61.45,50.05 IC10.37 59.05,50.05 | 61.35,48.85 IC10.40 59.15,48.85 | 63.17,47.8 IC10.43 63.17,45.67 | 63.98,45.52 IC10.45 63.98,48.48 | 65.97,47.98 IC10.50 65.97,45.8 | 67.58,45.83 IC10.54 67.58,48.42 | 65.17,47.83 IC10.48 65.17,45.7 | IC10.35 59.27,50.85 | 59.38,56.45 IC10.21 61.27,56.45 | 61.6,54.45 IC10.26 59.55,54.45
  other vias: 32.5,18.5 34,15.5 49.12,55.02 37.62,62.02 25,60.42 5.62,69.03 5.7,15.6 36.12,8.53 40.12,17.02 37.12,1.52 9.62,9.03 32.12,22.52 52.12,59.52 56.62,56.02 60.62,45.17 46.23,42.77 47.15,47.27 71.75,41.48 72.3,47.4 76.42,60.27 73.08,63.75 66.17,52.65 64.67,52.65 67.67,52.65 69.17,52.65 69.17,51.15 69.17,49.65 67.67,51.15 66.17,51.15 64.67,51.15 63.17,52.65 63.17,51.15 64.67,49.65 66.17,49.65 67.67,49.65 67.67,54.15 69.17,54.15 69.17,55.65 67.67,55.65 66.17,55.65 66.17,54.15 64.67,54.15 63.17,54.15 63.17,49.65 63.17,55.65 60.62,46.85 74.35,47.08 54.62,54.52 62.25,44.83 72.1,46.1 60.62,43.67 61.2,59.27 65.28,61.88 52.62,57.02 75.08,65.75 75.58,68.25 78.08,70.25 32.08,27.25 39.08,31.75 34.58,29.75 4.08,40.75 11.07,41.25 16.57,40.75 30.07,39.25 32.08,12.75 42.58,66.25 49.58,66.75 44.58,64.25 51.08,64.75 10.62,69.03 4.75,17.1 25.95,46.4 50.12,52.12 17.07,44.75 10.57,46.75 4.58,43.75 4.08,51.25 4.58,20.75 19.07,25.75 28.07,25.75 9.12,2.75 29.07,35.75 24.07,38.25 24.07,35.75 19.57,34.75 19.57,31.75 19.57,29.25 22.57,29.25 23.57,32.75 20.57,38.75 22.57,25.75 26.4,38.6 8.22,15.43
  pour Top: 0,80 80,80 80,40 44,40 41.5,37.5 41.5,0 0,0
  pour Bottom (isolate 0.254): 0,80 80,80 80,40 44,40 41.5,37.5 41.5,0 0,0
GNDI
  pour Bottom (isolate 0.305, rank 2): 45.5,0 80,0 80,36.5 47,36.5 45.5,35
  pour Top (isolate 0.305, rank 2): 45.5,0 80,0 80,36.5 47,36.5 45.5,35
GNDINT  (via drill 0.3, 0.4, 0.6)
  Top 0.2: R10.1 25.07,21.82 25.55,21.35 C12.- | SW1.1 v3,17.75 | v8.93,16.75 10.25,16.75 C4.2
  Top 0.3: X3.5 31.01,70.61 28.6,68.2 26.46,68.2 C3.1 26.43,68.24 26.43,69.47 25.8,70.1 22.07,70.1 21.12,69.15 21.12,68.12 18.07,65.08 IC1.15 15.57,65.08 14.6,64.1 14.6,63.11 C7.1 14.56,63.08 11.5,63.08 | C10.1 10.64,50.01 12.05,48.6 13.82,48.6 13.9,48.52 14.33,48.52 IC6.4 | R14.1 10.75,28.98 v10.07,29.65 | 11.5,63.08 9.55,63.08 9.35,63.27 IC5.5 | v11.4,61.85 11.4,62.98 11.5,63.08 | C9.2 4.89,62.54 v4.92,62.5 | 29.52,29.63 30.33,29.63 30.57,29.88 31.29,29.88 C16.2
  Top 0.4: C10.1 10.64,57.74 14.62,61.73 14.62,63.06 C7.1 | R14.1 12.15,28.14 Q1.1
  Top 0.5: v26.6,27.6 26.6,29.09 IC8.1 | 14.33,48.52 14.33,45.15 v14.75,44.73 | v13.7,12.93 13.68,13.45 13.68,14.03 13.07,14.62 11.32,14.62 10.55,15.4 C4.2 | IC2.2 21.35,20 D3.A C11.2
  Top 0.6: IC8.1 28.14,29.32 28.45,29.62 29.47,29.62 C17.2 29.52,29.63 29.52,27.57 31,26.1 v31,15.78 | 12.97,11.97 13.7,12.7 v13.7,12.93 | C11.2 25.47,19.92 C12.- 27.5,20 v28.1,19.4
  Bottom 0.2: v3,17.75 3,18.05 3.75,18.8 6.88,18.8 v8.93,16.75
  Bottom 0.3: v11.4,61.85 11.05,61.5 5.92,61.5 v4.92,62.5
  Bottom 0.5: v26.6,27.6 26.4,27.4 12.32,27.4 v10.07,29.65 10.07,30.98 10.85,31.75 15.12,31.75 16.4,33.02 16.4,37.65 14.75,39.3 v14.75,44.73
  Bottom 0.6: 17.95,7.05 13.7,11.3 v13.7,12.93 13.72,12.95 13.72,14.05 14.53,14.85 17.15,14.85 19.07,12.93 28.15,12.93 v31,15.78 31,18.55 30.15,19.4 v28.1,19.4
HUMI&TEMP1
  Top 0.3: IC5.7 6.82,68.86 10.97,73.03 X3.1
INT  (via drill 0.3)
  Top 0.2: IC11.32 33.7,49.4 v34.2,48.9 | SJ1.2 34.35,38.02 v34.12,38.25
  Bottom 0.2: v34.12,38.25 34.12,48.83 v34.2,48.9
LINKLED  (via drill 0.3)
  Top 0.2: IC10.66 72.8,50.85 73.25,50.4 73.47,50.4 v73.7,50.17
  Bottom 0.2: v73.7,50.17 73.7,50.02 74.5,49.23 77.2,49.23 78.05,50.08 78.05,67.78 78.04,67.78 73.58,72.25 73.58,73.88 70.83,76.62 70.83,77.97 J1.L4
MISO  (via drill 0.3)
  Top 0.2: IC10.27 58.95,54.05 v58.52,54.48
  Top 0.3: JP1.1 53.27,42.47 52.25,41.45 41.42,41.45 40.17,42.7 IC11.16
  Bottom 0.2: JP1.1 53.3,43.35 55.58,43.35 58.92,46.7 58.92,50.58 58.35,51.15 58.35,51.95 58.52,52.12 v58.52,54.48
MOSI  (via drill 0.4)
  Top 0.2: JP1.4 51.98,47.17 54.48,47.17 54.85,47.55 54.85,52.02 55.42,52.6 55.45,52.6 56.5,53.65 IC10.28
  Top 0.3: IC11.15 38.5,43.7 38.15,44.05 v38.15,45.92
  Bottom 0.3: JP1.4 v38.15,45.92
N$9
  Top 0.3: IC1.5 24,67.03 24.2,67.22 26.25,67.22 26.43,67.05 26.43,66.39 C5.1
N$11
  Top 0.3: IC11.7 Q4.1
N$12
  Top 0.3: IC11.8 31.25,44.2 31.02,43.98 31.02,43 30.61,42.59 Q4.3
N$13
  Top 0.3: C5.2 IC1.4
N$14
  Top 0.3: IC1.6 23.82,67.67 24.35,68.2 24.89,68.2 C3.2
N$15
  Top 0.3: IC1.2 19.98,65.08 19.2,64.3 19.2,63.11 C2.2
N$16
  Top 0.3: IC1.1 C1.2
N$17
  Top 0.3: IC1.3 23.93,65.72 24.25,65.4 26.18,65.4 26.4,65.17 26.4,64.44 C1.1
N$18
  Top 0.3: R22.2 46.17,60.27 46.36,60.46 R26.2 46.51,61.7 X4.3
N$19
  Top 0.3: 15.51,19.75 R1.1 | IC2.5 17.95,20 18.25,20.3 18.25,22.32
  Top 0.5: IC2.5 16.3,20 16.07,19.77 15.54,19.77 R1.1 13.29,19.74 | 13.29,19.74 D1.C | C4.1 13.35,19.68 13.29,19.74
N$20
  Top 0.3: R19.1 LED1.A
N$22
  Top 0.2: R21.1 69.75,44.16 69.75,45.33 69.17,45.9 IC10.58 IC10.57 68.78,48.02 68.55,48.25 68.15,48.25 67.97,48.08 IC10.55
N$23
  Top 0.2: R18.1 72.84,59.98 R17.2
N$24
  Top 0.2: J1.L3 60.27,76.5 58.17,78.6 R29.2
N$25
  Top 0.2: J1.L1 57.43,76.5 56.85,75.92 56.85,74.65 56.33,74.12 55.81,74.12 R28.2
N$26
  Top 0.2: RN1.6 RN1.5 53.65,66.09 C36.1
N$27  (via drill 0.3)
  Top 0.2: SJ1.1 39.15,38.02 40,38.88 v40,39.3 | IC10.56 68.38,45.5 v68.45,45.42
  Bottom 0.2: v68.45,45.42 64.12,41.1 41.8,41.1 v40,39.3
N$28
  Top 0.2: RN1.7 RN1.8 53.65,60.94 C29.1
N$29
  Top 0.2: IC10.1 71.47,58.53 R18.2
N$30
  Top 0.4: 12.21,37.44 L2.2
  Top 0.5: IC8.8 13.69,36.94 L2.2
N$31
  Top 0.5: 21.4,17.7 D3.C 21.43,15.61 C8.2 | IC2.6 17.1,16.6 L1.2
  Top 0.6: L1.2 17.98,16.1 19.95,16.1 20.45,15.6 C8.2
N$32
  Top 0.2: IC2.3 21.1,20.95 21.95,21.8 22.89,21.8 R10.2 R9.1
N$33  (via drill 0.3)
  Top 0.2: IC2.1 19.9,17.85 v20,17.75 | v23,14.43 23,15.56 C8.1 24.18,15.6 24.5,15.28 D4.C
  Bottom 0.2: v20,17.75 20,14.65 20.48,14.18 22.75,14.18 v23,14.43
N$34  (via drill 0.3)
  Top 0.2: v15.47,22.77 15.47,21.29 R1.2 15.51,21.25 16.12,21.25 16.43,20.95 IC2.4 | X1.5 10.12,3.85 4.12,9.85 3.05,9.85 SW1.2
  Bottom 0.2: X1.5 12.94,8.58 11.93,9.6 11.93,22.12 12.95,23.15 15.1,23.15 v15.47,22.77
N$35
  Top 0.3: R24.2 40.1,60.98 | 40.1,60.98 40.1,61.39 R27.2 | X4.1 36.51,67.02 40.23,63.3 40.23,61.1 40.1,60.98
N$36
  Top 0.3: IC11.20 C24.1
N$37
  Top 0.3: IC11.18 42.63,45 L4.2 42.88,42.88 C23.1
N$38  (via drill 0.7)
  Top 0.5: IC7.8 IC7.7 IC7.6 IC7.5
  Top 0.6: v3.27,29.3 4.82,29.3 IC7.8
  Bottom 0.6: X3.4 26,73.35 24.2,71.55 4.65,71.55 1.52,68.42 1.52,30.98 3.2,29.3 v3.27,29.3
N$39
  Top 0.3: Q1.2 13.55,28.85 11.55,30.85 9.72,30.85 9.12,31.45 3.38,31.45 2,32.83 2,59.8 3.77,61.58 7.8,61.58 8.1,61.88 8.1,64.67 IC5.6
N$40
  Top 0.2: IC10.76 73.12,54.85 73.83,55.55 Q5.3 74.67,55.6 74.67,56.58 75.17,57.08 C25.2 77.66,57.59 78.75,56.5 R20.2
N$41
  Top 0.3: IC7.4 8.67,24.06 R13.1 10.68,26.54 R14.2 10.85,26.51 Q1.3 12.9,25.88 12.68,25.65 ZD2.A
N$42  (via drill 0.3)
  Top 0.2: R16.2 IC9.4 55.6,44.6 v55.25,44.95 | IC10.31 58.33,52.45 57.48,51.6 v57.48,50.7
  Bottom 0.2: v55.25,44.95 55.25,48.48 v57.48,50.7
N$43
  Top 0.2: JP2.4 32.54,57.66 34.02,59.15 34.02,61.34 SJ2.2
N$49
  Top 0.2: Q5.1 77.03,49.59 C26.2 | IC10.75 72.97,54.45 74.03,53.4 76.22,53.4 77.03,52.6 Q5.1 | R20.1 78.75,52.33 77.92,51.5 77.08,51.5 Q5.1
P1_ADC
  Top 0.3: R25.2 R24.1 C33.1 D10.3 39.95,55.98 38.5,54.52 IC11.26
P2_ADC
  Top 0.3: IC11.25 43.19,51.29 43.9,52 43.9,54.95 44.52,55.58 D9.3 46.23,58.04 R22.1 | C32.1 R22.1 | R22.1 R23.2
RESET  (via drill 0.4)
  Top 0.3: JP1.5 53.27,51.23 v51.5,53 | v36.1,52.7 IC11.29 | R15.1 27.96,50.68 C22.2 29.24,50.69 v29.43,50.5
  Bottom 0.3: v29.43,50.5 31.35,50.5 33.55,52.7 v36.1,52.7 36.2,52.7 37.5,54 50.5,54 v51.5,53
RHT03  (via drill 0.4)
  Top 0.3: IC11.12 36.1,41.45 35.42,40.77 24.12,40.77 22.27,42.62 20.5,42.62 | 20.5,42.62 10.4,42.62 6.82,46.21 IC5.2 | R2.1 21.11,56.69 v21.18,56.75 | v20.57,41.67 20.57,42.55 20.5,42.62
  Bottom 0.3: v20.57,41.67 20.57,53.58 21.18,54.17 v21.18,56.75
RIN  (via drill 0.4)
  Top 0.3: 16.38,67.03 v15.35,67.03 IC1.12 | IC6.3 15.87,49.87 16.52,50.52 16.52,57.4 v17.02,57.9
  Bottom 0.3: 15.5,66.88 v15.35,67.03 17.02,65.35 v17.02,57.9
RST  (via drill 0.3)
  Top 0.2: v38.33,35.67 38.3,35.67 37.65,35.02 33.55,35.02 v32.15,36.42 | v30.93,49 IC11.2 | IC10.59 69.58,46.1 70.17,45.5 70.53,45.5 70.92,45.1 v70.92,44.38
  Bottom 0.2: v38.33,35.67 41,38.35 41,39.1 42.52,40.62 67.17,40.62 v70.92,44.38 | v32.15,36.42 32.15,47.77 v30.93,49
RXD
  Top 0.3: IC1.13 18.02,66.38 19.77,68.12 19.77,72.22 21.02,73.47 21.02,75.97 X3.3
RXI
  Top 0.2: IC11.30 35.3,52.65 34.08,53.88 31.62,53.88 JP2.3
  Top 0.3: JP2.3 29.77,55.5 26.82,58.45 19.32,58.45 17.12,56.25 17.12,51.12 18.39,49.87 IC6.6
RXIN
  Top 0.2: J1.8 61.07,65.25 61.62,65.25 62.62,66.25 62.62,67.78 63.12,68.28 68.97,68.28 70,67.25 70,66.25 69.35,65.6 69.35,63.83 67.97,62.45 IC10.6 | 59.72,63.9 J1.8 | RN1.3 56.15,63.9 56.55,63.5 59.32,63.5 J1.8
RXIP
  Top 0.2: IC10.5 68.38,62.27 69.75,63.65 69.75,65.42 70.4,66.08 70.4,67.42 | 70.4,67.42 69.15,68.67 62.2,68.67 61.33,67.8 J1.7 61.33,66.17 60.55,65.4 59.58,65.4 58.88,64.7 58.88,64.25 58.52,63.9 56.73,63.9 55.92,64.7 RN1.4 | 70.42,67.4 70.4,67.42
SCK  (via drill 0.4)
  Top 0.2: 53.3,45.9 53.83,45.9 55.3,47.38 55.3,51.8 55.65,52.15 57.3,52.15 58,52.85 IC10.30
  Top 0.3: 53.3,45.9 JP1.3 | IC11.17 39.42,44.2 v39.02,44.6
  Bottom 0.3: JP1.3 53.08,45.92 51.83,44.67 39.1,44.67 v39.02,44.6
SEN-RST
  Top 0.3: IC11.11 35.3,41.58 35,41.27 24.35,41.27 22.5,43.12 10.62,43.12 7.33,46.42 7.33,57.08 8.09,57.84 IC5.3
SH
  Top 0.4: J1.SH1 J1.SH2 74.59,70.08 L6.2
SPDLED  (via drill 0.3)
  Top 0.2: IC10.67 73.42,51.25 v73.45,51.33
  Bottom 0.2: v73.45,51.33 73.65,51.33 74.45,50.52 74.45,49.92 74.7,49.67 77.03,49.67 77.6,50.25 77.6,65.75 76.25,67.1 71.64,67.1 J1.L2
STATUS
  Top 0.3: IC11.24 R19.2
TEMP
  Top 0.2: IC12.2 34.88,66.12 36,65 36,57.5 37.7,55.8 IC11.27
TOUT  (via drill 0.4)
  Top 0.3: IC1.11 16.07,67.67 15.32,68.42 v15.32,69.67 | IC6.2 15.66,51.13 15.97,51.45 15.97,59.4 16.65,60.08 19.45,60.08 v20.32,60.95
  Bottom 0.3: v20.32,60.95 20.45,61.08 20.45,67.62 18.4,69.67 v15.32,69.67
TXD
  Top 0.3: X3.2 16,73.5 14,71.5 14,66.5 14.78,65.72 IC1.14
TXO
  Top 0.2: IC11.31 34.5,52.88 33.9,53.48 29.48,53.48 JP2.2
  Top 0.3: JP2.2 27.46,56.39 25.93,57.92 19.55,57.92 17.62,56 17.62,51.7 18.19,51.13 IC6.7
TXON
  Top 0.2: IC10.9 66.78,60.58 66.03,61.33 66.03,62.59 66.14,62.7 | J1.2 66.21,62.77 66.14,62.7 | RN1.1 55.92,62.3 56.33,62.7 66.14,62.7
TXOP
  Top 0.2: IC10.8 67.17,60.77 66.42,61.52 66.42,62.4 67.17,63.15 68.1,63.15 68.94,63.99 68.94,65.4 | J1.1 68.94,65.4 | RN1.2 65.95,63.1 66.58,63.73 66.58,64.72 67.12,65.28 68.82,65.28 68.94,65.4

### Text on the board
_tplace: DATA | TXD | RXD | 24V | GND | P1+ | P1- | P2+ | P2- | PRESSURE SENSOR | DTR | TXO | RXI | +3.3V | GND | Trigger Isolation Circuit V6.0 | DC6~30V IN | TRIGGER IN | RESET | RST | - | CH2 | CH1 | +